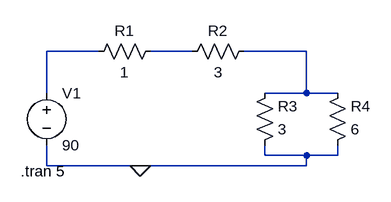
[diagram p0: schematic Q01.asc]
Q01.asc, the LTspice schematic file:
Version 4
SHEET 1 880 680
WIRE 128 64 48 64
WIRE 272 64 208 64
WIRE 448 64 352 64
WIRE 48 128 48 64
WIRE 448 128 448 64
WIRE 448 128 384 128
WIRE 496 128 448 128
WIRE 384 224 384 208
WIRE 448 224 384 224
WIRE 496 224 496 208
WIRE 496 224 448 224
WIRE 48 240 48 208
WIRE 192 240 48 240
WIRE 448 240 448 224
WIRE 448 240 192 240
FLAG 192 240 0
SYMBOL voltage 48 112 R0
WINDOW 123 0 0 Left 0
WINDOW 39 0 0 Left 0
SYMATTR InstName V1
SYMATTR Value 90
SYMBOL res 224 48 R90
WINDOW 0 0 56 VBottom 2
WINDOW 3 32 56 VTop 2
SYMATTR InstName R1
SYMATTR Value 1
SYMBOL res 368 48 R90
WINDOW 0 0 56 VBottom 2
WINDOW 3 32 56 VTop 2
SYMATTR InstName R2
SYMATTR Value 3
SYMBOL res 368 224 M180
WINDOW 0 36 76 Left 2
WINDOW 3 36 40 Left 2
SYMATTR InstName R3
SYMATTR Value 3
SYMBOL res 480 224 M180
WINDOW 0 36 76 Left 2
WINDOW 3 36 40 Left 2
SYMATTR InstName R4
SYMATTR Value 6
TEXT 8 248 Left 2 !.tran 5

The netlist it stands for:
* Q01.asc
V1 N001 0 90
R1 N002 N001 1
R2 N003 N002 3
R3 0 N003 3
R4 0 N003 6
.tran 5
.backanno
.end